# EAGLE design CocoMake7_USB-stick_SMD_v01_stahl (EAGLE 6.5.0)
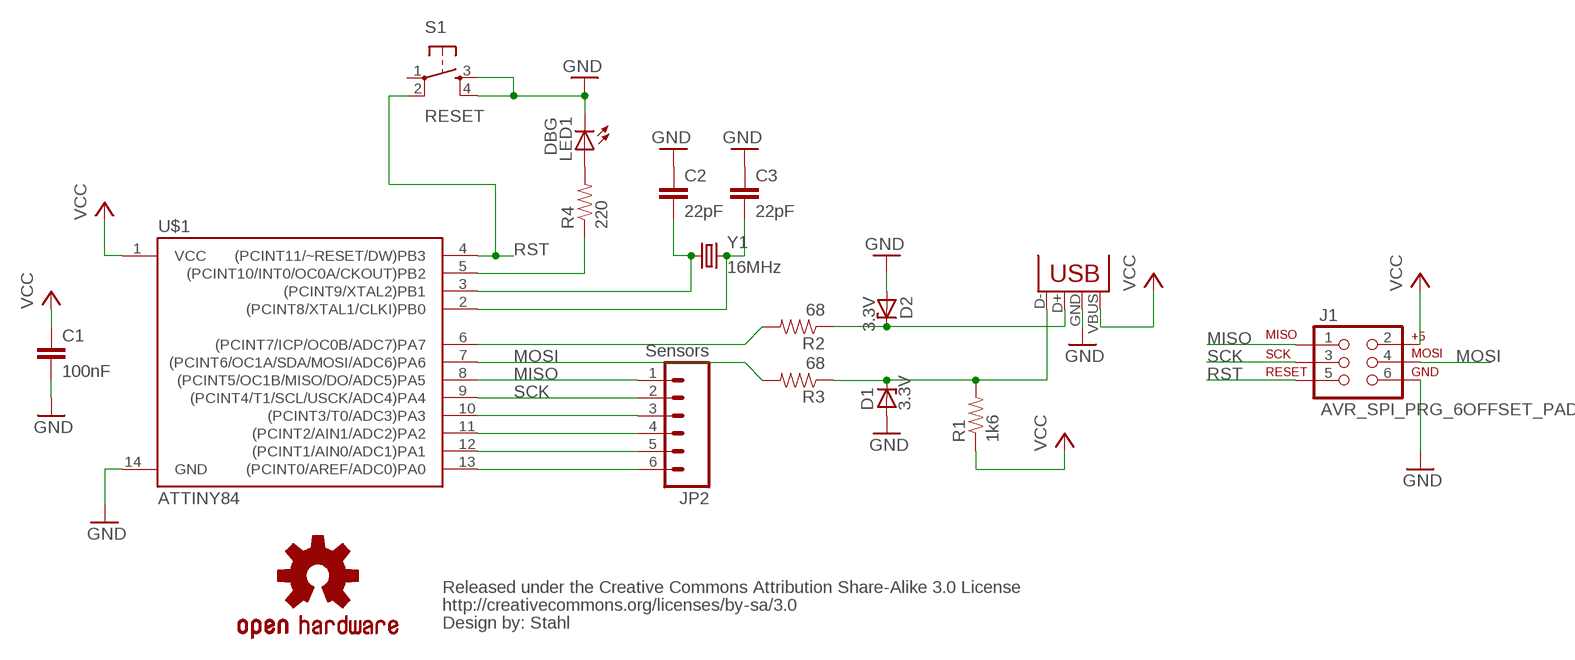
[diagram p0: schematic, sheet 1]

## Parts
C1  100nF  CAP1206  [1206]
C2  22pF  CAP1206  [1206]
C3  22pF  CAP1206  [1206]
CC_TEXT1  CREATIVE_COMMONS  [CREATIVE_COMMONS]
D1  3.3V  ZENER-DIODESOD80C  [SOD80C]
D2  3.3V  ZENER-DIODESOD80C  [SOD80C]
J1  AVR_SPI_PRG_6OFFSET_PADS  [2X3_OFFSET]
JP1  USB-A-H  [USB-A-H]
JP2  Sensors  M06LONGPADS  [1X06_LONGPADS]
LED1  DBG  LED1206  [LED-1206]
LOGO1  OSHW-LOGOS  [OSHW-LOGO-S]
R1  1k6  RESISTOR1206  [1206]
R2  68  RESISTOR1206  [1206]
R3  68  RESISTOR1206  [1206]
R4  220  RESISTOR1206  [1206]
S1  RESET  TAC_SWITCHSMD  [TACTILE_SWITCH_SMD]
U$1  ATTINY84  [SO14]
Y1  16MHz  CRYSTALSMD  [HC49UP]

## Nets
GND: C1.2 C2.1 C3.1 D1.A D2.A J1.6 JP1.GND(VBUS) LED1.C S1.3 S1.4 U$1.14(GND)
MISO: J1.1 JP2.1 U$1.8((PCINT5/OC1B/MISO/DO/ADC5)PA5)
MOSI: J1.4 R3.2 U$1.7((PCINT6/OC1A/SDA/MOSI/ADC6)PA6)
N$1: D2.C JP1.D+(D-) R2.1
N$2: R2.2 U$1.6((PCINT7/ICP/OC0B/ADC7)PA7)
N$3: C3.2 U$1.2((PCINT8/XTAL1/CLKI)PB0) Y1.2
N$4: JP2.6 U$1.13((PCINT0/AREF/ADC0)PA0)
N$5: C2.2 U$1.3((PCINT9/XTAL2)PB1) Y1.1
N$6: R4.1 U$1.5((PCINT10/INT0/OC0A/CKOUT)PB2)
N$7: LED1.A R4.2
N$8: JP2.5 U$1.12((PCINT1/AIN0/ADC1)PA1)
N$9: JP2.4 U$1.11((PCINT2/AIN1/ADC2)PA2)
N$10: JP2.3 U$1.10((PCINT3/T0/ADC3)PA3)
N$11: D1.C JP1.D-(D+) R1.2 R3.1
RST: J1.5 S1.2 U$1.4((PCINT11/~RESET/DW)PB3)
SCK: J1.3 JP2.2 U$1.9((PCINT4/T1/SCL/USCK/ADC4)PA4)
VCC: C1.1 J1.2 JP1.VBUS(GND) R1.1 U$1.1(VCC)
Unconnected: S1.1

## Library data of the parts
C1-C3 = SparkFun-Capacitors:CAP: Capacitor Standard 0603 ceramic capacitor, and 0.1" leaded capacitor.
CC_TEXT1 = SparkFun-Aesthetics:CREATIVE_COMMONS: Creative Commons License summary
D1 D2 = diode:ZENER-DIODE: Z-Diode
J1 = SparkFun-Connectors:AVR_SPI_PRG_6: AVR ISP 6 Pin This is the reduced ISP connector for AVR programming. Common on Arduino. This footprint will take up less PCB space and can be used with a 10-pin to 6-pin adapter such as SKU: BOB-08508
JP1 = SparkFun-Connectors:USB: USB Connectors USB-B-PTH is fully proven SKU : PRT-00139/CONN-08278 USB-miniB is fully proven SKU : PRT-00587 USB-A-PCB is untested. USB-A-H is throughly reviewed, but untested. Spark Fun Electronics SKU : PRT-00437 USB-B-SMT is throughly reviewed, but untested. Needs silkscreen touching up. USB-A-S has not been used/tested USB-MB-H has not been used/tested USB-MICROB has been used. CONN-09505
JP2 = SparkFun-Connectors:M06: Header 6 Standard 6-pin 0.1" header. Use with straight break away headers (SKU : PRT-00116), right angle break away headers (PRT-00553), swiss pins (PRT-00743), machine pins (PRT-00117), and female headers (PRT-00115). Molex polarized connector foot print use with SKU : PRT-08094 with associated crimp pins and housings. NOTES ON THE VARIANTS LOCK and LOCK_LONGPADS... This footprint was designed to help hold the alignment of a through-hole component (i.e. 6-pin header) while soldering it into place. You may notice that each hole has been shifted either up or down by 0.005 of an inch from it's more standard position (which is a perfectly straight line). This slight alteration caused the pins (the squares in the middle) to touch the edges of the holes. Because they are alternating, it causes a "brace" to hold the component in place. 0.005 has proven to be the perfect amount of "off-center" position when using our standard breakaway headers. Although looks a little odd when you look at the bare footprint, once you have a header in there, the alteration is very hard to notice. Also,if you push a header all the way into place, it is covered up entirely on the bottom side. This idea of altering the position of holes to aid alignment will be further integrated into the Sparkfun Library for other footprints. It can help hold any component with 3 or more connection pins.
LED1 = SparkFun-LED:LED: LEDs Standard schematic elements and footprints for 5mm, 3mm, 1206, and 0603 sized LEDs. 5mm - Spark Fun Electronics SKU : COM-00529 (and others)
LOGO1 = SparkFun-Aesthetics:OSHW-LOGO: Open Source Hardware Logo This logo indicates the piece of hardware it is found on incorporates a OSHW license and/or adheres to the definition of open source hardware found here: http://freedomdefined.org/OSHW
R1-R4 = SparkFun-Resistors:RESISTOR: Resistor Basic schematic elements and footprints for 0603, 1206, and PTH resistors.
S1 = SparkFun-Electromechanical:TAC_SWITCH: Momentary Switch Button commonly used for reset or general input. Spark Fun Electronics SKU : COM-00097 SMT- SWCH-08247; PROD_ID: SWCH-08247
U$1 = SparkFun-DigitalIC:ATTINY84: Atmel 14-pin 2/4/8kB flash uC
Y1 = SparkFun-FreqCtrl:CRYSTAL: Various standard crystals. Proven footprints. Spark Fun Electronics SKU : COM-00534

## Board
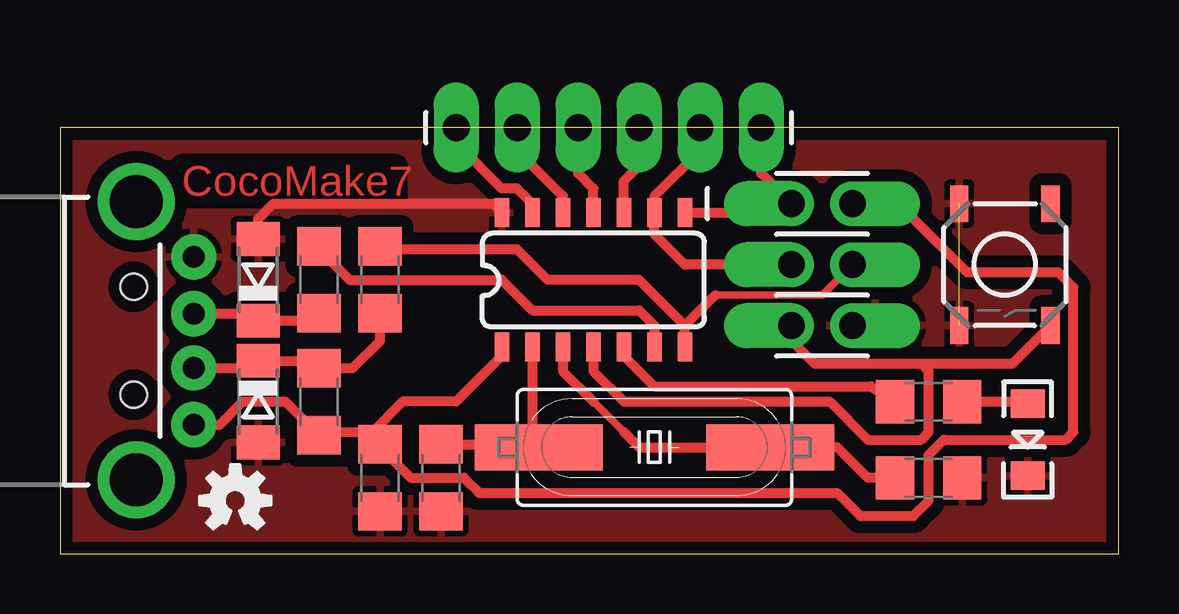
[diagram p1: board, top side]

Size 44.12 x 17.77 mm. Coordinates in mm from the lower left corner, seen from the top.
Outline: 0,0 44.12,0 44.12,17.77 0,17.77 0,0
Copper layers (1*16): Top 0.035mm / dielectric 1.5mm / Bottom 0.035mm
Design rules "default *": minimum track width 10mil, minimum drill 24mil, track to track 8mil, track to pad 8mil, pad to pad 8mil, via to via 8mil, smd to smd 8mil, copper to edge 10mil, drill to drill 8mil, minimum pad ring 10mil, minimum via ring 8mil, stop-mask expansion 4mil, vias tented up to drill 0mil, thermal gap 10mil
tKeepout: area 5.1,14.9 to 15.2,16.2

### Footprints (pad centres in the part's own frame; a part is rotated, then mirrored left to right if it is on the bottom)
1206 = smd 1.6 x 1.8: 1 -1.4,0; 2 1.4,0
SOD80C = smd 1.4 x 1.8: A 1.7,0; C -1.7,0
2X3_OFFSET = drill 1.118 pad 1.88 offset: 1 -2.54,-1.27; 2 -2.54,1.27; 3 0,-1.27; 4 0,1.27; 5 2.54,-1.27; 6 2.54,1.27
USB-A-H = drill 0.914 pad 1.88: D+ 2.4,1.127; D- 2.4,-1.127; GND 2.4,3.5; VBUS 2.4,-3.5 | drill 2.2: GND2 0,-5.8; GND3 0,5.8 | hole 1.1: -0.1,2.25; -0.1,-2.25
1X06_LONGPADS = drill 1.118 pad 1.88 long: 1 0,0; 2 2.54,0; 3 5.08,0; 4 7.62,0; 5 10.16,0; 6 12.7,0
LED-1206 = smd 1.2 x 1.4: A -1.5,0; C 1.5,0
TACTILE_SWITCH_SMD = smd 1.524 x 0.762: 1 -2.54,1.905; 2 2.54,1.905; 3 -2.54,-1.905; 4 2.54,-1.905
SO14 = smd 0.6 x 1.2: 1 -3.81,-2.8; 2 -2.54,-2.8; 3 -1.27,-2.8; 4 0,-2.8; 5 1.27,-2.8; 6 2.54,-2.8; 7 3.81,-2.8; 8 3.81,2.8; 9 2.54,2.8; 10 1.27,2.8; 11 0,2.8; 12 -1.27,2.8; 13 -2.54,2.8; 14 -3.81,2.8
HC49UP = smd 5.334 x 1.93: 1 -4.826,0; 2 4.826,0

### Placement (x,y rotation side)
C1  13.34,3.17 270 top
C2  36.2,3.17 180 top
C3  15.88,3.17 90 top
CC_TEXT1  -13.97,-11.43 0 top  (outside the outline)
D1  8.26,6.35 270 top
D2  8.26,11.43 90 top
J1  31.75,12.07 270 top
JP1  3.17,8.89 0 top
JP2  29.21,17.78 180 top
LED1  40.32,4.76 270 top
LOGO1  7.3,2.22 0 top
R1  10.79,6.35 90 top
R2  10.79,11.43 90 top
R3  13.34,11.43 90 top
R4  36.2,6.35 0 top
S1  39.37,12.07 270 top
U$1  22.23,11.43 0 top
Y1  24.77,4.44 180 top

### Tracks (layer width: path | path; a pad name or v marks a point on that pad's centre or on a via)
GND  (1 unrouted)
  Top 0.406: D2.A 8.26,13.97 8.89,14.61 18.04,14.61 U$1.14
  pour Top (isolate 0.5): 0,17.14 43.5,17.14 43.5,0.63 0,0.63
MISO
  Top 0.406: U$1.8 30.11,14.23 J1.1 29.21,15.87 JP2.1
MOSI
  Top 0.305: 27.3,10.79 31.75,10.79 J1.4
  Top 0.406: U$1.7 26.04,9.53 | 26.04,9.53 27.3,10.79 | 26.04,9.53 24.13,11.43 20.32,11.43 19.05,12.7 13.46,12.7 R3.2
N$1
  Top 0.406: JP1.D+ 7.97,10.02 D2.C 10.49,9.73 R2.1
N$2
  Top 0.406: R2.2 10.79,12.7 12.06,11.43 18.41,11.43 19.68,10.16 24.13,10.16 24.77,9.53 U$1.6
N$3
  Top 0.406: U$1.2 19.68,5.08 | 19.68,5.08 19.68,4.7 Y1.2 | C3.2 19.18,4.57 19.68,5.08
N$4
  Top 0.406: U$1.13 19.68,14.61 19.05,15.24 18.41,15.24 16.51,17.14 JP2.6
N$5
  Top 0.305: 22.23,6.35 23.5,5.08
  Top 0.406: U$1.3 20.95,7.62 22.23,6.35 | 23.5,5.08 24.13,4.44 Y1.1 32.38,4.44 33.66,3.17 C2.2
N$6
  Top 0.406: U$1.5 23.5,8.25 24.77,6.98 33.78,6.98 R4.1
N$7
  Top 0.406: R4.2 40.23,6.35 LED1.A
N$8
  Top 0.406: U$1.12 20.95,14.92 19.05,16.83 JP2.5
N$9
  Top 0.406: U$1.11 22.23,15.24 21.59,15.87 JP2.4
N$10
  Top 0.406: U$1.10 23.5,15.56 24.13,16.19 JP2.3
N$11
  Top 0.406: JP1.D- 7.97,7.76 D1.C 10.49,8.05 R1.2 12.2,7.75 13.34,8.89 R3.1
RST
  Top 0.406: U$1.4 22.23,7.62 23.5,6.35 32.07,6.35 33.66,4.76 35.88,4.76 36.2,5.08 36.2,7.62 35.88,7.94 | J1.5 30.48,8.89 31.43,7.94 35.88,7.94 | 35.88,7.94 39.69,7.94 S1.2
SCK
  Top 0.406: J1.3 26.04,12.07 24.77,13.33 U$1.9 24.77,14.92 26.67,16.83 JP2.2
VCC
  Top 0.406: 12.95,5.01 12.89,5.08 10.79,5.08 R1.1 9.39,6.35 7.62,6.35 6.66,5.39 JP1.VBUS | 12.95,5.01 C1.1 13.34,4.44 14.61,3.17 16.83,3.17 17.46,2.54 32.38,2.54 33.34,1.59 35.56,1.59 36.2,2.22 36.2,4.13 36.83,4.76 41.91,4.76 42.23,5.08 42.23,11.11 41.59,11.75 37.78,11.75 34.92,14.61 J1.2 | U$1.1 18.41,8.25 16.51,6.35 14.28,6.35 12.95,5.01

### Text on the board
Top: CocoMake7